# Altium schematic sheet CC110L_868-915MHz.SchDoc
size A4
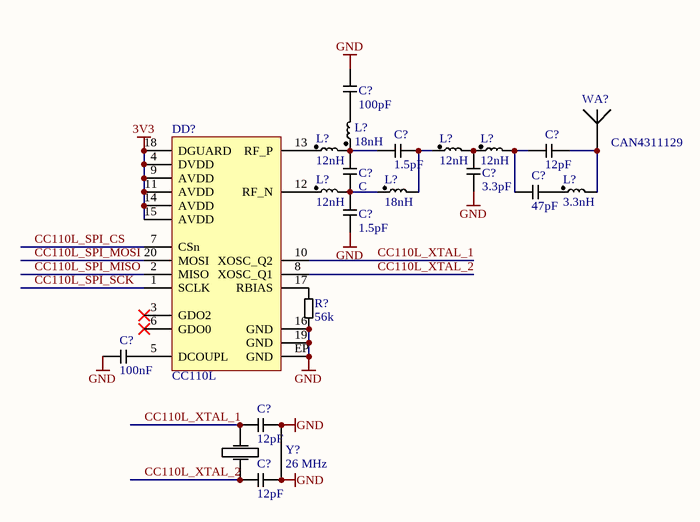
[diagram p0: CC110L_868-915MHz.SchDoc]

## Parts
(Parts that share a designator on the sheet are numbered #1, #2 ... from top to bottom, then left to right.)
C?#1  100pF  [C0603]
C?#2  1.5pF  [C0603]
C?#3  12pF  [C0603]
C?#4  C  [C0603]
C?#5  3.3pF  [C0603]
C?#6  47pF  [C0603]
C?#7  1.5pF  [C0603]
C?#8  100nF  [C0603]
C?#9  12pF  [C0603]
C?#10  12pF  [C0603]
DD?  CC110L  [QFN-20]
L?#1  18nH  [L0603]
L?#2  12nH  [L0603]
L?#3  12nH  [L0603]
L?#4  12nH  [L0603]
L?#5  12nH  [L0603]
L?#6  18nH  [L0603]
L?#7  3.3nH  [L0603]
R?  56k  [R0603]
WA?  CAN4311129  [CAN4311129090871K]
Y?  26 MHz  [Xtal 0532]

## Nets
3V3: DD?.4(DVDD) DD?.9(AVDD) DD?.11(AVDD) DD?.14(AVDD) DD?.15(AVDD) DD?.18(DGUARD)
GND: C?#1.1 C?#5.1 C?#7.2 C?#8.1 C?#9.2 C?#10.2 DD?.16(GND) DD?.19(GND) DD?.EP(GND) R?.1 Y?.1(X1) Y?.3(X2)
CC110L_SPI_CS: DD?.7(CSn)
CC110L_SPI_MISO: DD?.2(MISO)
CC110L_SPI_MOSI: DD?.20(MOSI)
CC110L_SPI_SCK: DD?.1(SCLK)
CC110L_XTAL_1: C?#9.1 DD?.10(XOSC_Q2) Y?.4(GND)
CC110L_XTAL_2: C?#10.1 DD?.8(XOSC_Q1) Y?.2(GND)
NetC?#1_2: C?#1.2 L?#1.2
NetC?#2_1: C?#2.1 C?#4.1 L?#1.1 L?#2.2
NetC?#2_2: C?#2.2 L?#3.1 L?#6.2
NetC?#3_1: C?#3.1 C?#6.1 L?#4.2
NetC?#3_2: C?#3.2 L?#7.2 WA?.1(ANT)
NetC?#4_2: C?#4.2 C?#7.1 L?#5.2 L?#6.1
NetC?#5_2: C?#5.2 L?#3.2 L?#4.1
NetC?#6_2: C?#6.2 L?#7.1
NetC?#8_2: C?#8.2 DD?.5(DCOUPL)
NetDD?_12: DD?.12(RF_N) L?#5.1
NetDD?_13: DD?.13(RF_P) L?#2.1
NetDD?_17: DD?.17(RBIAS) R?.2

Not connected (* = marked no-connect by the designer): DD? 3(GDO2)* 6(GDO0)*

## Library data of the parts
C?#1-C?#10 = C: Capacitor
DD? = CC110L: Value Line Transceiver
L?#1-L?#7 = L: Inductor
R? = R: Resistor
WA? = 868 MHz ANT
Y? = Xtal: Quartz crystal